# EasyEDA Pro project ProPrj_EPM_PCB.epro

# Schematic Schematic1
Board Name: Board1; Create Date: 2025-04-23; Page Name: P1; Project Name: epm10; Schematic Name: Schematic1; Update Date: 2025-04-23; Company: 嘉立创EDA; Page Size: A4; Version: V1.0
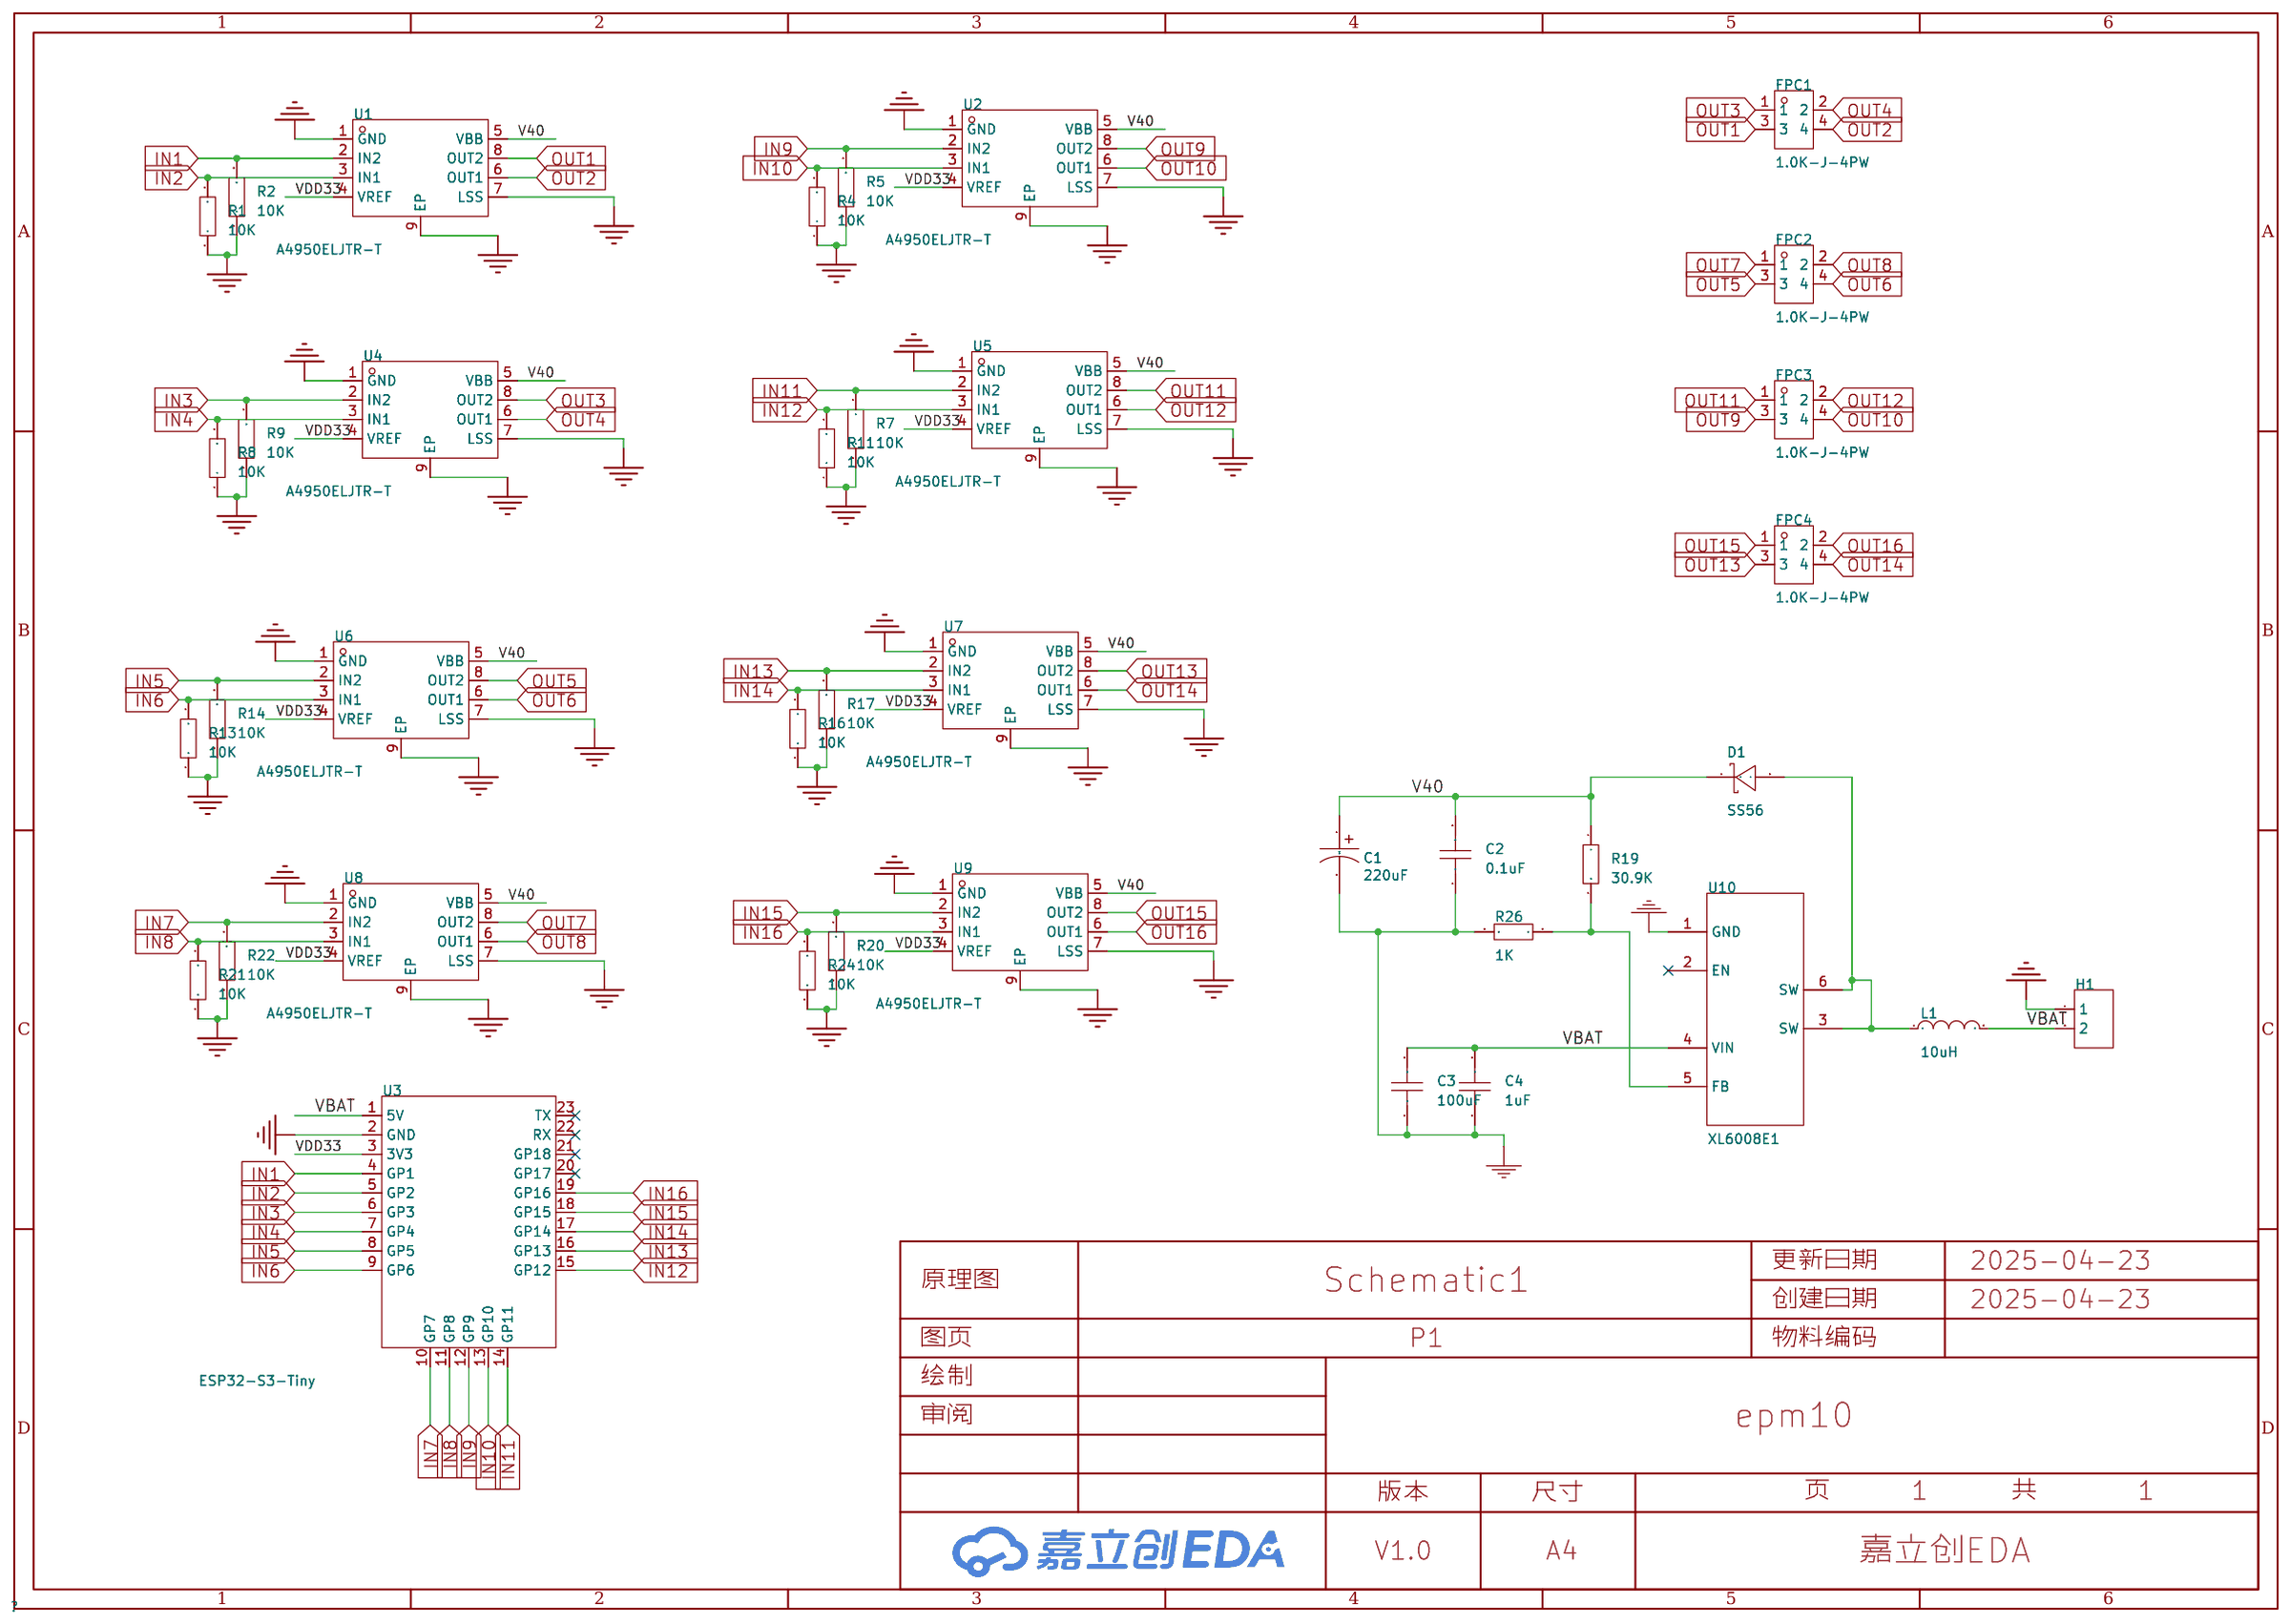
[diagram p0: schematic sheet]

## Parts
C1  220uF  [CAP-TH_BD10.0-P5.00-D0.6-FD-A]
C2  0.1uF  [C0603]
C3  100uF  [C1210]
C4  1uF  [C0603]
D1  SS56  [SMA_L4.3-W2.6-LS5.2-RD]
FPC1  1.0K-J-4PW  [FPC-TH_4P-P1.00_HDGC_1.0K-J-4PW]
FPC2  1.0K-J-4PW  [FPC-TH_4P-P1.00_HDGC_1.0K-J-4PW]
FPC3  1.0K-J-4PW  [FPC-TH_4P-P1.00_HDGC_1.0K-J-4PW]
FPC4  1.0K-J-4PW  [FPC-TH_4P-P1.00_HDGC_1.0K-J-4PW]
H1  -  [HDR-TH_2P-P2.54-V-F]
L1  10uH  [IND-SMD_L3.0-W3.0_FTC303020D]
R1  10K  [R0603]
R2  10K  [R0603]
R4  10K  [R0603]
R5  10K  [R0603]
R7  10K  [R0603]
R8  10K  [R0603]
R9  10K  [R0603]
R11  10K  [R0603]
R13  10K  [R0603]
R14  10K  [R0603]
R16  10K  [R0603]
R17  10K  [R0603]
R19  30.9K  [R0603]
R20  10K  [R0603]
R21  10K  [R0603]
R22  10K  [R0603]
R24  10K  [R0603]
R26  1K  [R0603]
U1  A4950ELJTR-T  [ESOP-8_L4.9-W3.9-P1.27-LS6.0-BL-EP-1]
U2  A4950ELJTR-T  [ESOP-8_L4.9-W3.9-P1.27-LS6.0-BL-EP-1]
U3  ESP32-S3-Tiny  [COMM-SMD_23P-P2.54-L23.5-W18.0_ESP32-S3-TINY]
U4  A4950ELJTR-T  [ESOP-8_L4.9-W3.9-P1.27-LS6.0-BL-EP-1]
U5  A4950ELJTR-T  [ESOP-8_L4.9-W3.9-P1.27-LS6.0-BL-EP-1]
U6  A4950ELJTR-T  [ESOP-8_L4.9-W3.9-P1.27-LS6.0-BL-EP-1]
U7  A4950ELJTR-T  [ESOP-8_L4.9-W3.9-P1.27-LS6.0-BL-EP-1]
U8  A4950ELJTR-T  [ESOP-8_L4.9-W3.9-P1.27-LS6.0-BL-EP-1]
U9  A4950ELJTR-T  [ESOP-8_L4.9-W3.9-P1.27-LS6.0-BL-EP-1]
U10  XL6008E1  [TO-252-5_L6.6-W5.8-P1.27-TL]

## Library data of the parts
C1 = 220uF: Supplier: LCSC; Supplier Part: C2983797; Manufacturer: AISHI(艾华集团); Manufacturer Part: SPZ1JM221G15O00RAXXX; JLCPCB Part Class: Extended Part
C2 C4 = CAP_0603: Supplier Footprint: 0603
C3 = GRM32ER61A107ME20L: 容值:100uF;精度:±20%;额定电压:10V;材质(温度系数):X5R;; LCSC Part Name: 100uF ±20% 10V; Supplier Part: C84455; Manufacturer: muRata(村田); Supplier Footprint: 1210; JLCPCB Part Class: 扩展库; Datasheet: https://atta.szlcsc.com/upload/public/pdf/source/20180228/C84455_15198056002791377611.pdf; Supplier: LCSC; Tolerance: ±20%; Voltage Rated: 10V; Temperature Coefficient: X5R
D1 = SS56_C65009: 二极管配置:独立式;正向压降(Vf):700mV@5A;直流反向耐压(Vr):60V;整流电流:5A;; LCSC Part Name: 电压:60V 电流:5A; Supplier Part: C65009; Manufacturer: MDD(辰达半导体); Supplier Footprint: SMA(DO-214AC); JLCPCB Part Class: 扩展库; Datasheet: https://atta.szlcsc.com/upload/public/pdf/source/20240710/73DFBB65C1883B895E62D589679033DF.pdf; Supplier: LCSC; Diode Configuration: 独立式; Forward Voltage (Vf@If): 700mV@5A; Reverse Voltage (Vr): 60V; Rectified Current: 5A; Reverse Leakage Current (Ir): 1mA@60V
FPC1-FPC4 = 1.0K-J-4PW: 锁定特性:抽屉式;触点类型:下接;触点数量:4P;间距:1mm;安装类型:弯插;工作温度范围:-20℃~+85℃;; LCSC Part Name: 间距:1mm P数:4P 抽屉式 下接; Supplier Part: C2915393; Manufacturer: HDGC(华德共创); Supplier Footprint: 弯插,P=1mm(交错脚); JLCPCB Part Class: 扩展库; Datasheet: https://atta.szlcsc.com/upload/public/pdf/source/20211109/62F60AB291C52E0B4B5ED5370B313C67.pdf; Supplier: LCSC; Locking Feature: 抽屉式; Contact Type: 下接; Number of Contacts: 4P; Pitch: 1mm; Mounting Type: 弯插; FFC, FCB Thickness: 0.3mm; Height Above Board: 2.5mm; Operating Temperature Range: -20℃~+85℃
H1 = HDR-F_2.54_1x2P: Supplier Part: C49661; Supplier Footprint: 插件
L1 = FTC303020D100MBCA: 电感值:10uH;精度:±20%;额定电流:2.5A;饱和电流(Isat):3.8A;类型:一体成型电感;; LCSC Part Name: 10uH ±20% 3.8A; Supplier Part: C7423323; Manufacturer: cjiang(长江微电); Supplier Footprint: SMD,3x3mm; JLCPCB Part Class: 扩展库; Datasheet: https://atta.szlcsc.com/upload/public/pdf/source/20230614/D39208D019DF4F1446B96572E3A14872.pdf; Supplier: LCSC; Tolerance: ±20%; Rated Current: 2.5A; Saturation Current (Isat): 3.8A; DC Resistance (DCR): 135mΩ; Type: 一体成型电感
R1 R2 R4 R5 R7-R9 R11 R13 R14 R16 R17 R19-R22 R24 R26 = Res_0603: Supplier Footprint: 0603
U1 U2 U4-U9 = A4950ELJTR-T_C5804620: 全桥DMOS PWM电机驱动器，直流有刷电机; Supplier Part: C5804620; Manufacturer: JSMSEMI(杰盛微); Supplier Footprint: ESOP-8; JLCPCB Part Class: 扩展库; Datasheet: https://atta.szlcsc.com/upload/public/pdf/source/20230505/87EBAC1C464EE98D7C585968504DD938.pdf; Supplier: LCSC
U3 = ESP32-S3-Tiny: Supplier Part: C9900126571; Supplier Footprint: SMD,18x23.5; Supplier: LCSC
U10 = XL6008E1: 功能类型:升降压型;输入电压:3.6V~32V;输出电流(最大值):3A;; Supplier Part: C73012; Manufacturer: XLSEMI(芯龙); Supplier Footprint: TO-252-5; JLCPCB Part Class: 扩展库; Datasheet: https://atta.szlcsc.com/upload/public/pdf/source/20160507/1462613618359.pdf; Supplier: LCSC; Function: 升降压型; Input Voltage: 3.6V~32V; Output Current (Max): 3A; Switching Frequency: 400kHz; Number of Outputs: 1; Topology: SEPIC；升压式；正激式；反激式; Switch tube (built-in/external): 内置

## Nets
GND: C1.2 C2.1 C3.1 C4.1 H1.1 R1.1 R2.1 R4.1 R5.1 R7.1 R8.1 R9.1 R11.1 R13.1 R14.1 R16.1 R17.1 R20.1 R21.1 R22.1 R24.1 R26.2 U1.1(GND) U1.7(LSS) U1.9(EP) U2.1(GND) U2.7(LSS) U2.9(EP) U3.2(GND) U4.1(GND) U4.7(LSS) U4.9(EP) U5.1(GND) U5.7(LSS) U5.9(EP) U6.1(GND) U6.7(LSS) U6.9(EP) U7.1(GND) U7.7(LSS) U7.9(EP) U8.1(GND) U8.7(LSS) U8.9(EP) U9.1(GND) U9.7(LSS) U9.9(EP) U10.1(GND)
V40: C1.1 C2.2 D1.1(K) R19.1 U1.5(VBB) U2.5(VBB) U4.5(VBB) U5.5(VBB) U6.5(VBB) U7.5(VBB) U8.5(VBB) U9.5(VBB)
VBAT: C3.2 C4.2 H1.2 L1.2 U3.1(5V) U10.4(VIN)
VDD33: U1.4(VREF) U2.4(VREF) U3.3(3V3) U4.4(VREF) U5.4(VREF) U6.4(VREF) U7.4(VREF) U8.4(VREF) U9.4(VREF)
IN1: R2.2 U1.2(IN2) U3.4(GP1)
IN2: R1.2 U1.3(IN1) U3.5(GP2)
IN3: R9.2 U3.6(GP3) U4.2(IN2)
IN4: R8.2 U3.7(GP4) U4.3(IN1)
IN5: R14.2 U3.8(GP5) U6.2(IN2)
IN6: R13.2 U3.9(GP6) U6.3(IN1)
IN7: R22.2 U3.10(GP7) U8.2(IN2)
IN8: R21.2 U3.11(GP8) U8.3(IN1)
IN9: R5.2 U2.2(IN2) U3.12(GP9)
IN10: R4.2 U2.3(IN1) U3.13(GP10)
IN11: R7.2 U3.14(GP11) U5.2(IN2)
IN12: R11.2 U3.15(GP12) U5.3(IN1)
IN13: R17.2 U3.16(GP13) U7.2(IN2)
IN14: R16.2 U3.17(GP14) U7.3(IN1)
IN15: R20.2 U3.18(GP15) U9.2(IN2)
IN16: R24.2 U3.19(GP16) U9.3(IN1)
OUT1: FPC1.3 U1.8(OUT2)
OUT2: FPC1.4 U1.6(OUT1)
OUT3: FPC1.1 U4.8(OUT2)
OUT4: FPC1.2 U4.6(OUT1)
OUT5: FPC2.3 U6.8(OUT2)
OUT6: FPC2.4 U6.6(OUT1)
OUT7: FPC2.1 U8.8(OUT2)
OUT8: FPC2.2 U8.6(OUT1)
OUT9: FPC3.3 U2.8(OUT2)
OUT10: FPC3.4 U2.6(OUT1)
OUT11: FPC3.1 U5.8(OUT2)
OUT12: FPC3.2 U5.6(OUT1)
OUT13: FPC4.3 U7.8(OUT2)
OUT14: FPC4.4 U7.6(OUT1)
OUT15: FPC4.1 U9.8(OUT2)
OUT16: FPC4.2 U9.6(OUT1)
$1N1624: D1.2(A) L1.1 U10.3(SW) U10.6(SW)
$1N1628: R19.2 R26.1 U10.5(FB)

Not connected (* = marked no-connect by the designer): U3 20(GP17)* 21(GP18)* 22(RX)* 23(TX)*; U10 2(EN)*

# Board PCB2
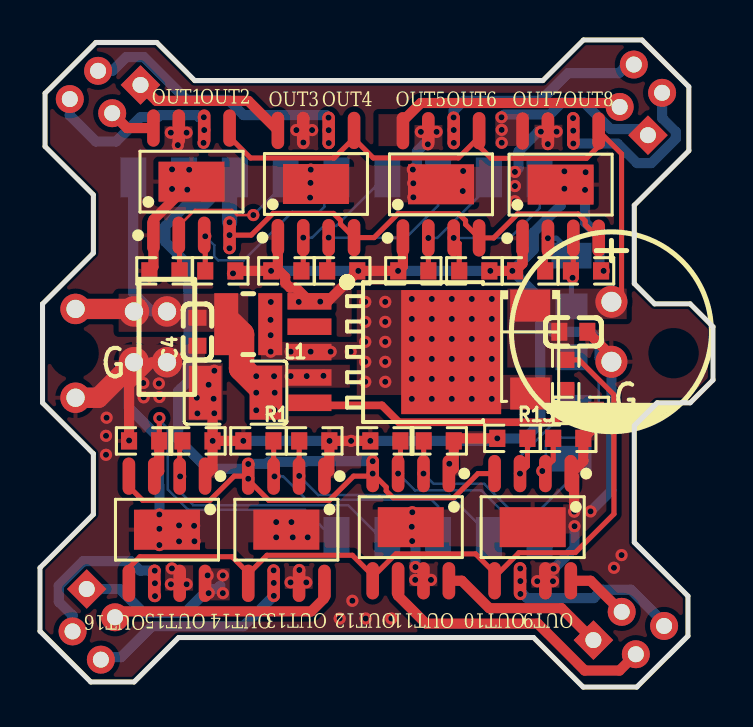
[diagram p1: board, top side]
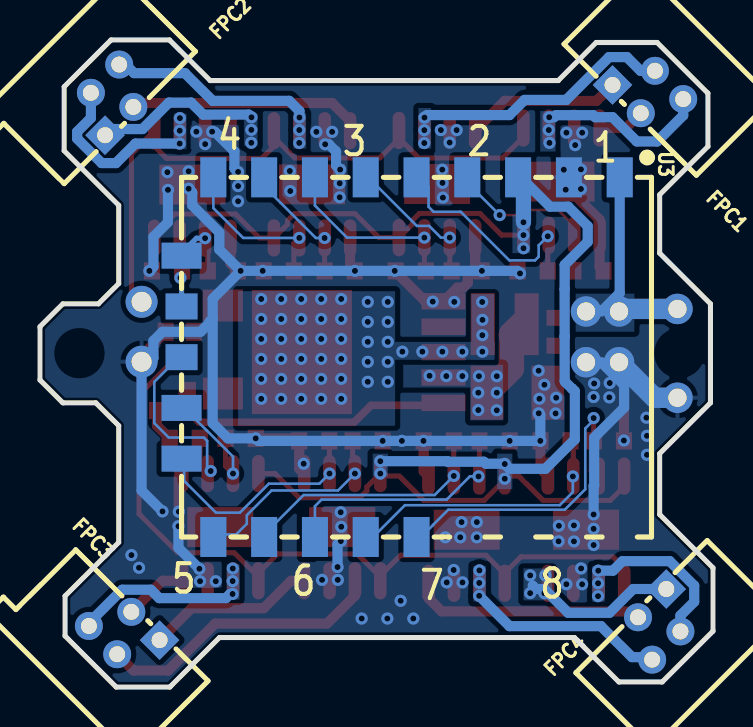
[diagram p2: board, bottom side, seen from below]

Outline 33.66 x 32.38 mm; copper layers: Top Layer, Bottom Layer. Coordinates in mm from the lower left corner of the outline.
Outline path: 0,5.97 2.67,8.64 2.67,11.68 0.13,14.22 0.13,19.18 2.67,21.72 2.67,24.64 0.25,27.05 0.25,29.72 2.79,32.26 5.84,32.26 7.74,30.35 25.15,30.35 27.18,32.38 30.1,32.38 32.45,30.04 32.45,26.84 29.72,24.11 29.72,20.19 30.73,19.18 32.51,19.18 33.66,18.03 33.66,15.37 32.51,14.22 30.86,14.22 29.72,13.08 29.72,7.24 32.4,4.55 32.4,2.56 29.84,0 27.16,0 24.68,2.48 6.93,2.48 4.71,0.25 2.54,0.25 0,2.79 0,5.97
Stack: Top Layer 0.035mm / Dielectric1 1.51mm FR4 er 4.5 / Bottom Layer 0.035mm

## Design rules (mm)
template: JLCPCB Capability(Two Layers Board)
spacing copperThickness1oz (default): track to track 0.102, other pairs 0.152 to 0.3
spacing copperThickness2oz: track to track 0.203, other pairs 0.152 to 0.3
track width copperThickness1oz (default): min 0.127, default 0.254, max 2.54
track width copperThickness2oz: min 0.203, default 0.254, max 2.54
differential pair differentialPair (default): width min 0.127, default 0.254, max 2.54; gap min 0.152, default 0.152
via viaSize (default): diameter min 0.5, default 0.61, max 10; hole min 0.3, default 0.305, max 6.3

## Placement (name value [footprint] x y rotation side)
C1  220uF  [CAP-TH_BD10.0-P5.00-D0.6-FD-A]  28.57 17.78 270 top
C2  0.1uF  [C0603]  26.67 17.78 180 top
C3  100uF  [C1210]  9.78 14.73 0 top
C4  1uF  [C0603]  7.87 17.78 90 top
D1  SS56  [SMA_L4.3-W2.6-LS5.2-RD]  24.51 16.89 270 top
FPC1  1.0K-J-4PW  [FPC-TH_4P-P1.00_HDGC_1.0K-J-4PW]  3.26 29.78 45 bottom
FPC2  1.0K-J-4PW  [FPC-TH_4P-P1.00_HDGC_1.0K-J-4PW]  30.05 29.39 315 bottom
FPC3  1.0K-J-4PW  [FPC-TH_4P-P1.00_HDGC_1.0K-J-4PW]  29.44 2.7 225 bottom
FPC4  1.0K-J-4PW  [FPC-TH_4P-P1.00_HDGC_1.0K-J-4PW]  2.69 3.14 135 bottom
H1  -  [HDR-TH_2P-P2.54-V-F]  6.35 17.53 90 top
L1  10uH  [IND-SMD_L3.0-W3.0_FTC303020D]  10.41 18.16 180 top
NOREF  -  [Pad_e511]  1.78 14.48 0 top
NOREF#2  -  [Pad_e193]  4.7 18.8 0 top
NOREF#3  -  [Pad_e510]  1.78 18.92 0 top
NOREF#4  -  [Pad_e197]  4.7 16.26 0 top
R1  10K  [R0603]  9.02 20.83 180 top
R2  10K  [R0603]  6.22 20.83 0 top
R4  10K  [R0603]  23.62 12.45 0 top
R5  10K  [R0603]  26.42 12.45 180 top
R7  10K  [R0603]  19.94 12.32 180 top
R8  10K  [R0603]  15.11 20.83 180 top
R9  10K  [R0603]  12.32 20.83 0 top
R11  10K  [R0603]  17.27 12.32 0 top
R13  10K  [R0603]  21.72 20.83 180 top
R14  10K  [R0603]  18.67 20.83 0 top
R16  10K  [R0603]  10.92 12.32 0 top
R17  10K  [R0603]  13.72 12.32 180 top
R19  30.9K  [R0603]  26.29 15.62 270 top
R20  10K  [R0603]  7.87 12.32 180 top
R21  10K  [R0603]  27.31 20.83 180 top
R22  10K  [R0603]  24.51 20.83 0 top
R24  10K  [R0603]  5.21 12.32 0 top
R26  1K  [R0603]  27.05 13.84 0 top
U1  A4950ELJTR-T  [ESOP-8_L4.9-W3.9-P1.27-LS6.0-BL-EP-1]  7.58 25.29 0 top
U2  A4950ELJTR-T  [ESOP-8_L4.9-W3.9-P1.27-LS6.0-BL-EP-1]  24.64 8 180 top
U3  ESP32-S3-Tiny  [COMM-SMD_23P-P2.54-L23.5-W18.0_ESP32-S3-TINY]  15.62 16.51 270 bottom
U4  A4950ELJTR-T  [ESOP-8_L4.9-W3.9-P1.27-LS6.0-BL-EP-1]  13.8 25.17 0 top
U5  A4950ELJTR-T  [ESOP-8_L4.9-W3.9-P1.27-LS6.0-BL-EP-1]  18.54 8 180 top
U6  A4950ELJTR-T  [ESOP-8_L4.9-W3.9-P1.27-LS6.0-BL-EP-1]  20.05 25.16 0 top
U7  A4950ELJTR-T  [ESOP-8_L4.9-W3.9-P1.27-LS6.0-BL-EP-1]  12.32 7.87 180 top
U8  A4950ELJTR-T  [ESOP-8_L4.9-W3.9-P1.27-LS6.0-BL-EP-1]  26.03 25.15 0 top
U9  A4950ELJTR-T  [ESOP-8_L4.9-W3.9-P1.27-LS6.0-BL-EP-1]  6.35 7.87 180 top
U10  XL6008E1  [TO-252-5_L6.6-W5.8-P1.27-TL]  17.02 16.76 0 top

## Footprints (pads in the part's own frame, mm; a bottom-side part is the same pattern mirrored in y, then rotated)
C0603
  rect 0.8x0.9 smd: 1(-0.7,0) 2(0.7,0)
C1210
  rect 1.635x2.7 smd: 1(-1.518,0) 2(1.518,0)
CAP-TH_BD10.0-P5.00-D0.6-FD-A
  round 1.6 hole 1: 1(-1.5,0) 2(1.5,0)
COMM-SMD_23P-P2.54-L23.5-W18.0_ESP32-S3-TINY
  rect 2x1.3 smd: 1(-9,10.955) 2(-9,8.415) 3(-9,5.875) 4(-9,3.335) 5(-9,0.795) 6(-9,-1.745) 7(-9,-4.285) 8(-9,-6.825) 9(-9,-9.365) 15(9,-9.365) 16(9,-6.825) 17(9,-4.285) 18(9,-1.745) 19(9,0.795)
  rect 1.3x2 smd: 10(-5.08,-10.955) 13(2.54,-10.955) 14(5.08,-10.955)
  rect 1.3x1.6 smd: 11(-2.54,-10.955) 12(0,-10.955)
ESOP-8_L4.9-W3.9-P1.27-LS6.0-BL-EP-1
  oval 0.63x1.865 smd: 1(-1.905,-2.683) 2(-0.635,-2.683) 3(0.635,-2.683) 4(1.905,-2.683) 5(1.905,2.683) 6(0.635,2.683) 7(-0.635,2.683) 8(-1.905,2.683)
  rect 3.3x2 smd: 9(0,0)
FPC-TH_4P-P1.00_HDGC_1.0K-J-4PW
  rect 1.4x1.4 hole 0.8: 1(1.5,1)
  round 1.4 hole 0.8: 2(0.5,-1) 3(-0.5,1) 4(-1.5,-1)
HDR-TH_2P-P2.54-V-F
  round 1.524 hole 0.914: 1(-1.27,0) 2(1.27,0)
IND-SMD_L3.0-W3.0_FTC303020D
  rect 1.2x3.1 smd: 1(-1.1,0) 2(1.1,0)
Pad_e193
  round 1.524 hole 0.914: 1(0,0)
Pad_e197
  round 1.524 hole 0.914: 1(0,0)
Pad_e510
  round 1.524 hole 0.914: 1(0,0)
Pad_e511
  round 1.524 hole 0.914: 1(0,0)
R0603
  rect 0.806x0.864 smd: 1(-0.753,0) 2(0.753,0)
SMA_L4.3-W2.6-LS5.2-RD
  rect 1.6x2 smd: 1(-2.2,0) 2(2.2,0)
TO-252-5_L6.6-W5.8-P1.27-TL
  rect 2.2x0.826 smd: 1(-3.543,2.54) 2(-3.543,1.27) 3(-3.543,0) 4(-3.543,-1.27) 5(-3.543,-2.54)
  rect 5x6.21 smd: 6(3.543,0)

## Nets
As in the schematic, except:
GND: C1.2 C2.1 C3.1 C4.1 H1.1 NOREF.1 NOREF#4.1 R1.1 R2.1 R4.1 R5.1 R7.1 R8.1 R9.1 R11.1 R13.1 R14.1 R16.1 R17.1 R20.1 R21.1 R22.1 R24.1 R26.2 U1.1 U1.7 U1.9 U2.1 U2.7 U2.9 U3.2 U4.1 U4.7 U4.9 U5.1 U5.7 U5.9 U6.1 U6.7 U6.9 U7.1 U7.7 U7.9 U8.1 U8.7 U8.9 U9.1 U9.7 U9.9 U10.1
VBAT: C3.2 C4.2 H1.2 L1.2 NOREF#2.1 NOREF#3.1 U3.1 U10.4

Pads without a net: U10 2

## Via types
v1: diameter 0.61, hole 0.305, Top Layer to Bottom Layer, 205 vias

## Routing (per net, layer and track width the routed paths; a pad name or vN(x,y) marks a point on that pad's centre or on a via; arc(x,y) is an arc through that point)
GND: length 134.3
  Top Layer w0.508: R24.1 4.45,15.12 5.59,16.26 ; 27.37,17.78 28.57,16.57 C1.2 ; U8.1 24.13,21.2 R22.1 R13.1 ; v1(16.52,12.32) v1(15.56,12.32) R17.1 14.47,10.8 U7.1 ; U6.1 18.15,21.06 R14.1 v1(15.92,20.83) ; U1.9 5.67,23.39 U1.1 5.67,21.03 R2.1 ; v1(15.92,20.83) 14.39,19.3 U10.1 12.79,19.99 12.5,19.99 12.26,20.23 12.26,20.52 11.95,20.83 R9.1 ; v1(15.92,20.83) R8.1 ; R9.1 11.89,21.16 U4.1 ; R9.1 R1.1 ; v1(8.68,14.43) 8.63,14.37 R20.1 ; v1(26.71,8.78) 26.71,10.52 U2.1 27.17,11.31 R5.1 27.8,13.08 R26.2 ; R20.1 v1(10.17,12.32) ; R20.1 8.63,10.93 U9.1 ; U5.1 20.69,10.93 R7.1 20.82,12.45 v1(22.87,12.45)
  Top Layer w1.016: NOREF#4.1 2.92,14.48 NOREF.1
  Bottom Layer w0.508: v1(23.62,20.83) v1(22.52,20.83) v1(17.91,20.83) v1(15.92,20.83) v1(11.56,20.83) 9.78,20.83 v1(9.65,20.7) ; v1(23.62,20.83) 24.69,21.89 24.69,22.76 26.04,24.11 26.04,24.76 v1(26.22,24.94) ; v1(23.62,20.83) 25.02,19.43 25.02,18.44 ; v1(5.97,8.64) 5.97,10.07 5.94,10.1 5.94,12.48 4.44,13.98 4.44,15.11 5.59,16.26 ; 25.02,18.44 25.02,13.21 24.26,12.45 v1(22.87,12.45) 22.74,12.32 v1(16.52,12.32) v1(15.56,12.32) v1(14.48,12.32) v1(10.17,12.32) v1(8.64,12.32) 8.64,13.62 v1(8.72,13.7) ; 25.02,18.44 25.17,18.29 25.17,18.23 25.62,17.78 27.53,17.78 27.98,17.33 27.98,16.47 28.17,16.28 C1.2 28.57,9.83 v1(27.53,8.79) ; v1(18.78,6.01) 18.78,7.14 v1(18.61,7.31) ; v1(27.25,24.88) 27.25,23.26 27.98,22.53 27.98,21.03 v1(28.19,20.83) ; v1(19.39,27.16) 19.21,27.16 18.85,26.8 18.85,26.1 v1(18.65,25.9) ; v1(25.05,27.79) 24.92,27.79 23.93,26.8 23.93,25.96 v1(23.75,25.78) ; v1(26.73,8.05) 26.73,6.96 v1(25.69,5.92)
  Bottom Layer w1.016: NOREF#4.1 2.92,14.48 NOREF.1
  vias: v1(3.33,13.48) v1(3.3,12.57) v1(3.3,11.62) v1(4.46,12.34) v1(5.16,15.21) v1(5.19,14.5) v1(5.94,15.19) v1(5.97,14.51) v1(5.97,7.92) v1(5.97,7.11) v1(6.54,27.74) v1(6.6,25.91) v1(6.6,24.93) v1(6.6,5.94) v1(6.55,5.14) v1(6.89,27.12) v1(6.95,8.09) v1(6.95,7.29) v1(7.33,27.74) v1(7.37,24.89) v1(7.33,5.15) v1(7.46,25.89) v1(7.71,8.07) v1(7.72,7.29) v1(7.84,14.48) v1(7.87,13.69) v1(8.43,15.13) v1(8.72,15.83) v1(11.81,8.25) v1(11.81,7.49) v1(12.53,5.24) v1(12.57,8.25) v1(12.64,7.49) v1(12.82,27.87) v1(12.94,19.28) v1(12.97,5.86) v1(13.17,27.25) v1(13.32,5.24) v1(13.39,7.49) v1(13.53,25.23) v1(13.51,24.49) v1(13.61,27.88) v1(13.54,25.89) v1(14.01,19.29) v1(14.99,3.43) v1(15.62,4.32) v1(16.28,3.43) v1(17.57,3.43) v1(18.62,8.75) v1(18.59,8.02) v1(18.67,25.21) v1(18.67,24.51) v1(18.76,5.36) v1(19.05,27.79) v1(19.55,5.36) v1(19.83,27.79) v1(20.47,11.17) v1(21.16,25.83) v1(21.14,24.82) v1(23.75,25.07) v1(23.75,24.31) v1(24.86,5.3) v1(25.4,27.17) v1(25.65,5.3) v1(25.84,27.79) v1(26.22,25.81) v1(27.28,25.77) v1(28.7,5.97) v1(29.08,6.6)
V40: length 71.4
  Top Layer w0.254: 15.7,27.47 15.7,27.44 16.66,26.48 20.92,26.48 21.96,27.52 ; 15.7,27.47 U4.5 ; 15.7,27.47 14.71,26.48 10.53,26.48 9.48,27.52 U1.5 ; 10.41,5.66 10.41,5.71 9.6,6.52 5,6.52 4.44,5.97 U9.5 ; 10.41,5.66 U7.5 ; 10.41,5.66 11.35,6.59 15.62,6.59 16.64,5.58 16.64,5.51 ; C1.1 29.08,19.79 29.08,26.69 U8.5 27.94,27.07 27.33,26.46 22.56,26.46 21.96,27.06 21.96,27.52 ; 16.64,5.51 U5.5 ; 16.64,5.51 17.79,6.66 21.78,6.66 22.73,5.71 22.73,5.51 ; R19.1 26.95,16.37 28.7,14.63 28.7,8.66 26.77,6.73 26.41,6.73 26.4,6.72 23.95,6.72 22.73,5.51 ; 22.73,5.51 22.67,5.44 22.67,5.38 U2.5 22.73,5.51 ; 21.96,27.52 21.96,27.84
VBAT: length 17.2
  Top Layer w1.016: NOREF#2.1 4.57,18.92 NOREF#3.1
  Top Layer w1.27: C3.2 10.08,15.95 10.08,17.65 9.57,18.16
  Bottom Layer w0.508: 4.67,25.51 4.67,19.72 5.59,18.8
  Bottom Layer w1.016: NOREF#2.1 4.57,18.92 NOREF#3.1
  vias: v1(10.81,15.56) v1(10.81,14.73) v1(10.81,13.85) v1(11.71,15.56) v1(11.74,14.73) v1(11.74,13.86) v1(12.53,15.56) v1(13.34,15.56) v1(14.17,15.58)
VDD33: length 72.3
  Top Layer w0.254: 4.41,10.54 4.4,10.52 4.4,10.43 ; v1(9.48,22.62) 10.56,22.62 11.65,23.7 ; U8.4 27.26,23.14 27.26,23.33 26.92,23.67 23.88,23.67 22.69,22.48 U6.4 21.28,23.15 21.28,23.34 20.93,23.69 17.9,23.69 16.71,22.49 U4.4 15.03,23.17 15.03,23.36 14.68,23.7 11.65,23.7 ; 4.53,10.43 4.4,10.43 ; 4.4,10.43 4.4,10.08 5.13,9.34 8.5,9.34 9.71,10.56 U7.4 10.41,10.37 11.44,9.34 14.47,9.34 15.68,10.56 16.51,10.56 v1(16.64,10.68) 17.31,10.01 17.31,9.82 17.66,9.47 20.69,9.47 21.9,10.68 U2.4
  Bottom Layer w0.508: v1(16.64,11.3) 13.28,11.3 13.26,11.28 11.46,11.28 11.36,11.18 10.43,11.18 v1(10.41,11.16) 10.17,10.92 8.38,10.92 6.91,12.39 6.91,14.8 7.04,14.94 7.06,14.94 7.38,15.26 7.38,15.28 7.42,15.31 7.42,17.55 7.42,17.55 7.42,19.91 7.42,19.92 7.42,21.13 6.27,22.28 6.27,23.07 7.24,24.04 8.15,24.04 9.48,25.37
  Bottom Layer w0.762: v1(9.48,23.26) 9.48,25.37 9.75,25.64
  vias: v1(9.48,21.96) v1(10.41,10.42)
IN1: length 9
  Top Layer w0.127: U1.2 6.94,23.07 7.75,23.88 9.6,23.88 9.85,23.62 v1(10.67,23.62)
  Top Layer w0.254: U1.2 6.98,22.58 R2.2
  Bottom Layer w0.127: v1(10.67,23.62) 12.29,25.24 12.29,25.51
IN2: length 11.6
  Top Layer w0.254: U1.3 v1(8.26,22.56) R1.2
  Bottom Layer w0.127: 14.83,25.64 14.22,25.03 14.22,24.03 13.97,23.78 12.61,23.78 10.18,21.35 8.9,21.35 8.72,21.54 8.72,22.11 v1(8.26,22.56)
IN3: length 7.2
  Top Layer w0.254: v1(13.16,22.49) 13.16,20.92 R9.2
  Bottom Layer w0.127: v1(13.16,22.49) 13.61,22.49 14.19,23.08 14.81,23.08 17.37,25.64
IN4: length 9.4
  Top Layer w0.254: R8.2 14.44,20.9 v1(14.44,22.49)
  Bottom Layer w0.127: v1(14.44,22.49) 18.3,22.49 19.91,24.1 19.91,25.64
IN5: length 6.3
  Top Layer w0.254: R14.2 v1(19.42,22.47) U6.2
  Bottom Layer w0.127: v1(19.42,22.47) 19.86,22.47 22.45,25.06 22.45,25.64
IN6: length 8.3
  Top Layer w0.254: R13.2 20.96,22.2 v1(20.69,22.48)
  Bottom Layer w0.127: 24.99,25.64 24.99,23.97 23.49,22.48 v1(20.69,22.48)
IN7: length 3.2
  Top Layer w0.254: R22.2 25.26,22.33 v1(25.4,22.46)
  Bottom Layer w0.254: v1(25.4,22.46) 25.83,22.46 26.58,21.72
IN8: length 3.3
  Top Layer w0.254: U8.3 26.67,20.52 v1(26.63,20.48)
  Bottom Layer w0.254: 26.58,19.18 26.58,20.43 v1(26.63,20.48)
IN9: length 10.5
  Top Layer w0.254: R5.2 25.66,11.35 v1(25.12,10.81)
  Bottom Layer w0.127: v1(25.12,10.81) 25.3,10.99 25.3,12.32 25.46,12.49 27.22,12.49 27.94,13.21 27.94,15.27 26.58,16.64
IN10: length 6.4
  Top Layer w0.254: R4.2 24.38,11.06 v1(24,10.68)
  Bottom Layer w0.127: 26.58,14.1 25.32,12.84 25.31,12.84 24,11.53 v1(24,10.68)
IN11: length 11.7
  Top Layer w0.254: v1(19.18,10.68) 19.19,10.69 R7.2
  Bottom Layer w0.127: v1(19.18,10.68) 19.69,10.18 22.21,10.18 23.66,8.73 24.85,8.73 26.45,10.32 26.45,11.43 26.58,11.56
IN12: length 10.3
  Top Layer w0.254: R11.2 18.03,10.8 v1(17.91,10.68)
  Bottom Layer w0.127: 24.99,7.64 23.84,7.64 23.31,8.17 23.31,8.6 22.07,9.84 18.75,9.84 v1(17.91,10.68)
IN13: length 12.5
  Top Layer w0.254: U7.2 v1(12.96,10.56) R17.2
  Bottom Layer w0.127: v1(12.96,10.56) 13.92,9.61 20.47,9.61 22.45,7.64
IN14: length 12
  Top Layer w0.254: U7.3 11.68,12.31 R16.2
  Bottom Layer w0.127: v1(11.73,10.54) 12.16,10.54 13.32,9.38 19.58,9.38 19.91,9.05 19.91,7.64
IN15: length 13.8
  Top Layer w0.254: R20.2 6.98,12.18 U9.2
  Bottom Layer w0.127: 17.37,7.64 16.87,7.64 15.41,9.1 7.66,9.1 7.01,9.76 v1(7.01,10.54)
IN16: length 16.1
  Top Layer w0.254: R24.2 5.97,12.33 v1(5.97,13.46)
  Top Layer w0.508: R24.2 5.96,10.8 U9.3
  Bottom Layer w0.127: 14.83,7.64 14.47,7.64 14,8.1 14,8.11 13.24,8.87 7.41,8.87 6.39,9.9 6.39,12.94 5.97,13.36 v1(5.97,13.46)
OUT1: length 2.4
  Top Layer w0.508: 3.61,28.72 4.35,27.98 5.67,27.98
OUT2: length 8.6
  Bottom Layer w0.508: 1.49,29.43 1.49,28.61 2.79,27.3 3.81,27.3 5.02,28.52 5.89,28.52 5.99,28.62 7.85,28.62 7.95,28.52 v1(8.19,28.52)
  vias: v1(8.21,27.88) v1(8.18,27.23)
OUT3: length 7.8
  Top Layer w0.508: U4.8 10.42,29.34 5.82,29.34 FPC1.1
OUT4: length 13.1
  Bottom Layer w0.508: FPC1.2 3.62,30.84 4.31,31.53 5.19,31.53 7.34,29.38 9.42,29.38 10.18,28.63 14.3,28.63 v1(14.43,28.5)
  vias: v1(14.44,27.87) v1(14.44,27.23)
OUT5: length 11.9
  Top Layer w0.508: 29.12,29.03 28.92,29.23 19.04,29.23 18.17,28.36 18.17,27.87 18.15,27.84
OUT6: length 10.5
  Bottom Layer w0.508: 29.82,31.15 29.74,31.23 29.46,31.23 28.95,30.73 26.41,30.73 25.02,29.34 21.19,29.34 20.68,28.83 v1(20.68,28.51)
  vias: v1(20.69,27.88) v1(20.69,27.23)
OUT7: length 8.3
  Bottom Layer w0.508: FPC2.1 30.09,27.93 28.53,27.93 27.21,29.25 26.1,29.25 25.49,28.65 23.21,28.65 v1(23.08,28.51)
  vias: v1(23.09,27.88) v1(23.09,27.24)
OUT8: length 8.6
  Bottom Layer w0.508: 26.67,27.2 28.88,27.2 29.85,26.22 30.57,26.22 31.8,27.45 31.8,27.79 31.11,28.48 31.11,29.74
  vias: v1(26.66,28.47) v1(26.67,27.84) v1(26.67,27.2)
OUT9: length 3.2
  Top Layer w0.508: U2.8 27.53,5.32 FPC3.3
OUT10: length 8.3
  Bottom Layer w0.508: FPC3.4 31.21,3.21 29.55,4.87 28.11,4.87 27.69,4.45 24.36,4.45 24.15,4.66 v1(24.03,4.66)
  vias: v1(24.01,5.93) v1(24.02,5.3)
OUT11: length 8.5
  Top Layer w0.508: U5.8 21.1,5.32 22.47,3.95 26.08,3.95 27.67,2.35
OUT12: length 14.5
  Top Layer w0.508: 29.8,1.64 28.98,0.83 27.24,0.83 24.89,3.17 19.3,3.17 17.91,4.57 U5.6
OUT13: length 11.7
  Top Layer w0.508: 3.62,3.62 3.79,3.78 13.56,3.78 14.19,4.41 14.19,5.16 U7.8
OUT14: length 10
  Bottom Layer w0.508: 2.92,1.5 4.05,1.5 5.6,3.05 10.18,3.05 v1(11.69,4.56)
  vias: v1(11.68,5.84) v1(11.69,5.21)
OUT15: length 7.7
  Bottom Layer w0.508: 9.02,5.08 8.84,4.91 8.43,4.91 7.24,3.72 5.18,3.72 3.99,4.91 2.34,4.91
  vias: v1(8.38,5.59) v1(8.43,4.7) v1(9.14,5.59) v1(9.14,4.7)
OUT16: length 8.1
  Bottom Layer w0.508: FPC4.2 1.63,3.58 0.94,4.27 0.94,5.07 2.17,6.3 4.53,6.3 5,5.82 5.72,5.82
  vias: v1(5.74,5.82) v1(5.75,5.19) v1(5.75,4.55)
$1N1624:
  vias: v1(11.53,18.38) v1(11.54,19.27) v1(11.54,17.61) v1(11.53,16.78) v1(12.53,16.78) v1(13.53,16.78) v1(14.53,16.78) v1(15.53,16.78) v1(16.26,19.28) v1(16.26,18.28) v1(16.26,17.28) v1(16.26,16.28) v1(16.26,15.28) v1(17.26,19.28) v1(17.26,18.28) v1(17.26,17.28) v1(17.26,16.28) v1(17.26,15.28) v1(18.59,19.42) v1(18.59,18.42) v1(18.59,17.42) v1(18.59,16.42) v1(18.59,15.42) v1(18.59,14.42) v1(19.59,19.42) v1(19.59,18.42) v1(19.59,17.42) v1(19.59,16.42) v1(19.59,15.42) v1(19.59,14.42) v1(20.59,19.42) v1(20.59,18.42) v1(20.59,17.42) v1(20.59,16.42) v1(20.59,15.42) v1(20.59,14.42) v1(21.59,19.42) v1(21.59,18.42) v1(21.59,17.42) v1(21.59,16.42) v1(21.59,15.42) v1(21.59,14.42) v1(22.59,19.42) v1(22.59,18.42) v1(22.59,17.42) v1(22.59,16.42) v1(22.59,15.42) v1(22.59,14.42)
$1N1628: length 13.5
  Top Layer w0.381: R26.1 26.17,13.72 26.15,13.72 25.69,13.25 17.95,13.25 17.1,14.1 13.6,14.1 U10.5

## Copper pours and planes (outline as drawn; the poured copper is in the pictures)
GND on Top Layer: 3.94,17.4 9.14,17.4 9.14,13.33 3.94,13.33
GND on Top Layer: 12.24,6.06 13.64,6.06 13.64,4.91 12.24,4.91
GND on Top Layer: 24.73,28.14 26.12,28.14 26.12,26.91 24.73,26.91
GND on Top Layer: 24.58,6.24 25.97,6.24 25.97,4.97 24.58,4.97
GND on Top Layer: 4.95,8.89 26.29,8.89 26.29,7.24 4.95,7.24
GND on Top Layer: -6.86,35.31 37.72,35.31 37.72,-4.19 -6.86,-4.19
GND on Top Layer: 26.16,9.14 28.07,9.14 28.07,7.68 26.16,7.68
GND on Top Layer: 18.47,6.18 19.87,6.18 19.87,5.04 18.47,5.04
GND on Top Layer: 12.51,29.37 13.9,29.37 13.9,26.91 12.51,26.91
GND on Top Layer: 6.26,6.09 7.66,6.09 7.66,4.82 6.26,4.82
GND on Top Layer: 18.73,28.13 20.12,28.13 20.12,26.91 18.73,26.91
GND on Top Layer: 5.97,26.03 27.69,26.03 27.69,24.26 5.97,24.26
GND on Top Layer: 6.22,28.07 7.62,28.07 7.62,26.8 6.22,26.8
GND on Bottom Layer: 7.5,16.21 9.15,16.21 9.15,11.86 7.5,11.86
GND on Bottom Layer: 3.86,17.38 6.83,17.38 6.83,15.49 3.86,15.49
GND on Bottom Layer: 23.37,26.03 24.13,26.03 24.13,24 23.37,24
GND on Bottom Layer: 13.24,26.84 13.8,26.84 13.8,24.21 13.24,24.21
GND on Bottom Layer: 18.29,9.02 19.05,9.02 19.05,6.86 18.29,6.86
GND on Bottom Layer: 5.59,9.02 6.35,9.02 6.35,6.73 5.59,6.73
GND on Bottom Layer: 12.24,7.96 13.64,7.96 13.64,4.91 12.24,4.91
GND on Bottom Layer: 26.42,9.14 28.07,9.14 28.07,7.69 26.42,7.69
GND on Bottom Layer: -6.99,35.43 37.08,35.43 37.08,-3.94 -6.99,-3.94
GND on Bottom Layer: 18.73,28.09 20.12,28.09 20.12,26.82 18.73,26.82
GND on Bottom Layer: 24.59,6.27 25.98,6.27 25.98,5 24.59,5
GND on Bottom Layer: 6.22,28.07 7.62,28.07 7.62,24.59 6.22,24.59
GND on Bottom Layer: 12.51,28.07 13.89,28.07 13.89,26.82 12.51,26.82
GND on Bottom Layer: 5.59,8.51 13.84,8.51 13.84,7.11 5.59,7.11
GND on Bottom Layer: 6.28,7.47 7.67,7.47 7.67,4.93 6.28,4.93
GND on Bottom Layer: 25.91,26.42 27.69,26.42 27.69,24.38 25.91,24.38
GND on Bottom Layer: 18.47,6.31 19.87,6.31 19.87,5.04 18.47,5.04
GND on Bottom Layer: 18.35,26.23 19.01,26.23 19.01,24.2 18.35,24.2
GND on Bottom Layer: 24.74,28.09 26.12,28.09 26.12,26.91 24.74,26.91
V40 on Top Layer: 23.37,19.94 26.71,19.94 26.71,15.99 23.37,15.99
V40 on Top Layer: 23.88,19.94 29.34,19.94 29.34,18.42 23.88,18.42
VBAT on Top Layer: 10.54,16.13 15.49,16.13 15.49,14.99 10.54,14.99
VBAT on Top Layer: 3.93,19.68 10.41,19.68 10.41,17.78 3.93,17.78
VBAT on Bottom Layer: 11.94,16.13 15.49,16.13 15.49,14.99 11.94,14.99
VBAT on Bottom Layer: 3.93,19.68 6.87,19.68 6.87,17.78 3.93,17.78
VBAT on Bottom Layer: 10.5,16.13 12.14,16.13 12.14,13.35 10.5,13.35
VDD33 on Bottom Layer: 9.14,23.62 10.03,23.62 10.03,21.72 9.14,21.72
VDD33 on Bottom Layer: 10.03,11.68 10.79,11.68 10.79,9.91 10.03,9.91
OUT2 on Bottom Layer: 7.87,28.83 8.64,28.83 8.64,26.8 7.87,26.8
OUT4 on Bottom Layer: 14.1,28.98 14.73,28.98 14.73,26.95 14.1,26.95
OUT5 on Top Layer: 16.93,28.67 18.36,28.67 18.36,27.07 16.93,27.07
OUT6 on Bottom Layer: 20.35,28.73 20.98,28.73 20.98,26.95 20.35,26.95
OUT7 on Top Layer: 22.77,28.68 24.46,28.68 24.46,27.08 22.77,27.08
OUT7 on Bottom Layer: 22.77,28.68 23.45,28.68 23.45,27.09 22.77,27.09
OUT8 on Bottom Layer: 26.33,28.7 26.96,28.7 26.96,26.92 26.33,26.92
OUT10 on Bottom Layer: 23.68,6.16 24.32,6.16 24.32,4.38 23.68,4.38
OUT14 on Bottom Layer: 11.35,6.06 11.98,6.06 11.98,4.28 11.35,4.28
OUT15 on Top Layer: 8.04,5.94 9.48,5.94 9.48,4.34 8.04,4.34
OUT15 on Bottom Layer: 8.04,5.94 9.48,5.94 9.48,4.34 8.04,4.34
OUT16 on Bottom Layer: 5.41,6.05 6.04,6.05 6.04,4.27 5.41,4.27
$1N1624 on Top Layer: 15.84,19.87 18.14,19.87 18.14,14.61 15.84,14.61
$1N1624 on Top Layer: 11.05,17.27 18.8,17.27 18.8,16.38 11.05,16.38
$1N1624 on Top Layer: 22.66,15.62 25.61,15.62 25.61,13.91 22.66,13.91
$1N1624 on Bottom Layer: 10.95,19.66 12.09,19.66 12.09,16.38 10.95,16.38
$1N1624 on Bottom Layer: 10.92,17.27 18.21,17.27 18.21,16.38 10.92,16.38
$1N1624 on Bottom Layer: 15.9,19.81 23.75,19.81 23.75,13.08 15.9,13.08
$1N1628 on Top Layer: 25.91,15.21 26.76,15.21 26.76,13.22 25.91,13.22

Small or netless copper shapes (teardrops, artwork), in the pictures only: 1 on Bottom Layer

## Text on the board
Bottom Silkscreen Layer: 1 | 8 | 2 | 7 | 3 | 6 | 4 | 5
Top Silkscreen Layer: G | OUT1 | OUT2 | OUT3 | OUT4 | OUT5 | OUT6 | OUT7 | OUT8 | OUT16 | OUT15 | OUT14 | OUT13 | OUT12 | OUT11 | OUT10 | OUT9
